# Altium schematic sheet ExtensionConnector.SchDoc: STM324x9I-EVAL Extension connector
size A4; DocumentNumber: 15; Revision: B.3; SheetNumber: 15; SheetTotal: 17
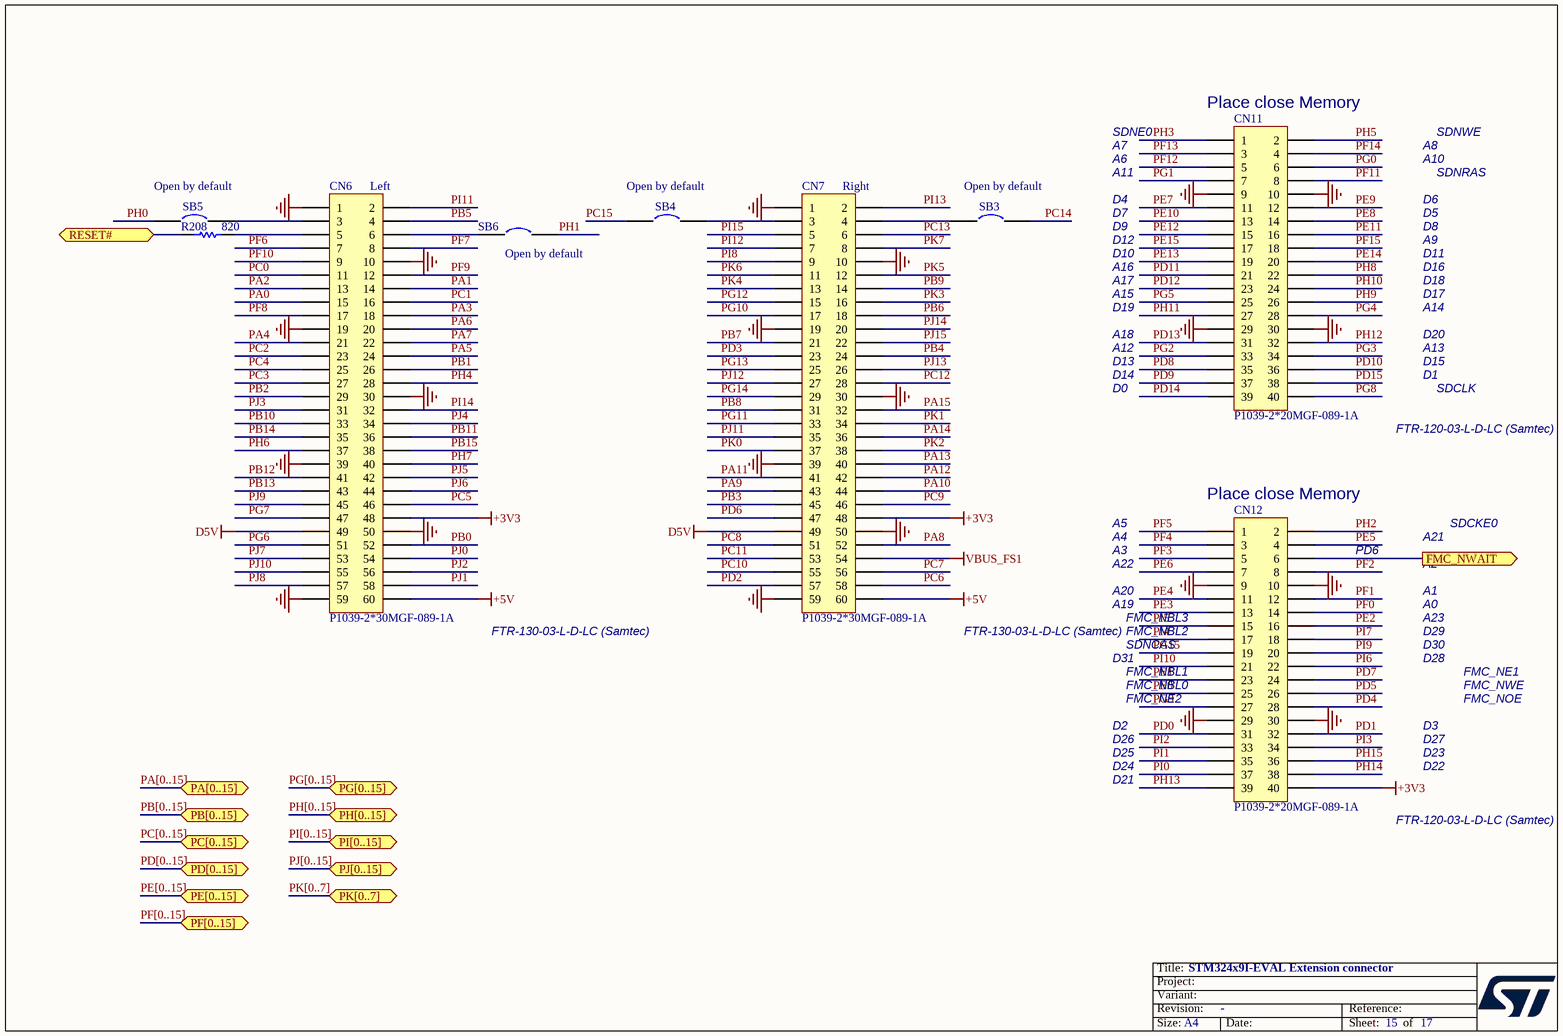
[diagram p0: ExtensionConnector.SchDoc]

## Parts
CN6  P1039-2*30MGF-089-1A  [FTR-130-53-L-D-LC]
CN7  P1039-2*30MGF-089-1A  [FTR-130-53-L-D-LC]
CN11  P1039-2*20MGF-089-1A  [FTR-120-53-L-D-LC]
CN12  P1039-2*20MGF-089-1A  [FTR-120-53-L-D-LC]
R208  820  [0603R]
SB3  (no value)  [JP2_SMD]
SB4  (no value)  [JP2_SMD]
SB5  (no value)  [JP2_SMD]
SB6  (no value)  [JP2_SMD]

## Ports
FMC_NWAIT (out), PA[0..15] (bidir), PB[0..15] (bidir), PC[0..15] (bidir), PD[0..15] (bidir), PE[0..15] (bidir), PF[0..15] (bidir), PG[0..15] (bidir), PH[0..15] (bidir), PI[0..15] (bidir), PJ[0..15] (bidir), PK[0..7] (bidir), RESET# (bidir)

## Nets
+3V3: CN6.48 CN7.48 CN12.40
+5V: CN6.60 CN7.60
D5V: CN6.49 CN7.49
GND: CN6.1 CN6.10 CN6.19 CN6.30 CN6.39 CN6.50 CN6.59 CN7.1 CN7.10 CN7.19 CN7.30 CN7.39 CN7.50 CN7.59 CN11.9 CN11.10 CN11.29 CN11.30 CN12.9 CN12.10 CN12.29 CN12.30
VBUS_FS1: CN7.54
FMC_NWAIT: CN12.6 ; port FMC_NWAIT
PA0: CN6.15
PA1: CN6.14
PA2: CN6.13
PA3: CN6.18
PA4: CN6.21
PA5: CN6.24
PA6: CN6.20
PA7: CN6.22
PA8: CN7.52
PA9: CN7.43
PA10: CN7.44
PA11: CN7.41
PA12: CN7.42
PA13: CN7.40
PA14: CN7.36
PA15: CN7.32
PB0: CN6.52
PB1: CN6.26
PB2: CN6.29
PB3: CN7.45
PB4: CN7.24
PB5: CN6.4
PB6: CN7.18
PB7: CN7.21
PB8: CN7.31
PB9: CN7.14
PB10: CN6.33
PB11: CN6.36
PB12: CN6.41
PB13: CN6.43
PB14: CN6.35
PB15: CN6.38
PC0: CN6.11
PC1: CN6.16
PC2: CN6.23
PC3: CN6.27
PC4: CN6.25
PC5: CN6.46
PC6: CN7.58
PC7: CN7.56
PC8: CN7.51
PC9: CN7.46
PC10: CN7.55
PC11: CN7.53
PC12: CN7.28
PC13: CN7.6
PC14: SB3.1
PC15: SB4.1
PD0: CN12.31
PD1: CN12.32
PD2: CN7.57
PD3: CN7.23
PD4: CN12.28
PD5: CN12.26
PD6: CN7.47
PD7: CN12.24
PD8: CN11.35
PD9: CN11.37
PD10: CN11.36
PD11: CN11.21
PD12: CN11.23
PD13: CN11.31
PD14: CN11.39
PD15: CN11.38
PE0: CN12.25
PE1: CN12.23
PE2: CN12.16
PE3: CN12.13
PE4: CN12.11
PE5: CN12.4
PE6: CN12.7
PE7: CN11.11
PE8: CN11.14
PE9: CN11.12
PE10: CN11.13
PE11: CN11.16
PE12: CN11.15
PE13: CN11.19
PE14: CN11.20
PE15: CN11.17
PF0: CN12.14
PF1: CN12.12
PF2: CN12.8
PF3: CN12.5
PF4: CN12.3
PF5: CN12.1
PF6: CN6.7
PF7: CN6.8
PF8: CN6.17
PF9: CN6.12
PF10: CN6.9
PF11: CN11.8
PF12: CN11.5
PF13: CN11.3
PF14: CN11.4
PF15: CN11.18
PG0: CN11.6
PG1: CN11.7
PG2: CN11.33
PG3: CN11.34
PG4: CN11.28
PG5: CN11.25
PG6: CN6.51
PG7: CN6.47
PG8: CN11.40
PG9: CN12.27
PG10: CN7.17
PG11: CN7.33
PG12: CN7.15
PG13: CN7.25
PG14: CN7.29
PG15: CN12.19
PH0: SB5.1
PH1: SB6.1
PH2: CN12.2
PH3: CN11.1
PH4: CN6.28
PH5: CN11.2
PH6: CN6.37
PH7: CN6.40
PH8: CN11.22
PH9: CN11.26
PH10: CN11.24
PH11: CN11.27
PH12: CN11.32
PH13: CN12.39
PH14: CN12.38
PH15: CN12.36
PI0: CN12.37
PI1: CN12.35
PI2: CN12.33
PI3: CN12.34
PI4: CN12.17
PI5: CN12.15
PI6: CN12.22
PI7: CN12.18
PI8: CN7.9
PI9: CN12.20
PI10: CN12.21
PI11: CN6.2
PI12: CN7.7
PI13: CN7.2
PI14: CN6.32
PI15: CN7.5
PJ0: CN6.54
PJ1: CN6.58
PJ2: CN6.56
PJ3: CN6.31
PJ4: CN6.34
PJ5: CN6.42
PJ6: CN6.44
PJ7: CN6.53
PJ8: CN6.57
PJ9: CN6.45
PJ10: CN6.55
PJ11: CN7.35
PJ12: CN7.27
PJ13: CN7.26
PJ14: CN7.20
PJ15: CN7.22
PK0: CN7.37
PK1: CN7.34
PK2: CN7.38
PK3: CN7.16
PK4: CN7.13
PK5: CN7.12
PK6: CN7.11
PK7: CN7.8
RESET#: R208.1 ; port RESET#
NetCN6_3: CN6.3 SB5.2
NetCN6_5: CN6.5 R208.2
NetCN6_6: CN6.6 SB6.2
NetCN7_3: CN7.3 SB4.2
NetCN7_4: CN7.4 SB3.2

## Buses and harness runs
bus PA[0..15] = port PA[0..15]
bus PB[0..15] = port PB[0..15]
bus PC[0..15] = port PC[0..15]
bus PD[0..15] = port PD[0..15]
bus PE[0..15] = port PE[0..15]
bus PF[0..15] = port PF[0..15]
bus PG[0..15] = port PG[0..15]
bus PH[0..15] = port PH[0..15]
bus PI[0..15] = port PI[0..15]
bus PJ[0..15] = port PJ[0..15]
bus PK[0..7] = port PK[0..7]

## Notes on the sheet
- (near CN11) Place close Memory
- A6
- A7
- A11
- SDNE0
- A8
- A10
- SDNRAS
- SDNWE
- Open by default
- (near CN6) Left
- (near SB4) Open by default
- (near CN7) Right
- (near SB3) Open by default
- D4
- D7
- D9
- D12
- D5
- D6
- D8
- A9
- (near SB6) Open by default
- A16
- A17
- D10
- A15
- D19
- D11
- A14
- D16
- D17
- D18
- D13
- D14
- A18
- A12
- D15
- D1
- A13
- D20
- D0
- (near CN11) FTR-120-03-L-D-LC (Samtec)
- SDCLK
- (near CN12) Place close Memory
- A22
- A3
- A4
- A5
- PD6
- A21
- A2
- SDCKE0
- (near CN6) FTR-130-03-L-D-LC (Samtec)
- (near CN7) FTR-130-03-L-D-LC (Samtec)
- A19
- A20
- SDNCAS
- FMC_NBL2
- FMC_NBL3
- A23
- A0
- A1
- D29
- D30
- D31
- FMC_NBL0
- FMC_NBL1
- FMC_NE2
- D28
- FMC_NOE
- FMC_NWE
- FMC_NE1
- D2
- D21
- D24
- D25
- D26
- D3
- D22
- D23
- D27
- (near CN12) FTR-120-03-L-D-LC (Samtec)
- Title:
- Project:
- Size:
- Revision:
- Variant:
- -
- Date:
- Reference:
- Sheet:
- of

## Library data of the parts
CN6 CN7 = FTR-130-53-L-D-LC: Header, 40-Pin, Dual row; Revision: 17-Jul-2002: Re-released for DXP Platform.; Publisher: Altium Limited
CN11 CN12 = FTR-120-53-L-D-LC: Header, 20-Pin, Dual row; Revision: 17-Jul-2002: Re-released for DXP Platform.; Publisher: Altium Limited
R208 = res1: Resistor; Value: 1K; Published: 8-Jun-2000; Revision: July-2002: Re-released for DXP Platform.; Publisher: Altium Limited
SB3-SB6 = Circuit Breaker: Published: 24-Mar-1999; Revision: July-2002: Re-released for DXP Platform.; Publisher: Altium Limited